# EAGLE design Adafruit Perma Proto Pi - Quarter Size (EAGLE 6.4)
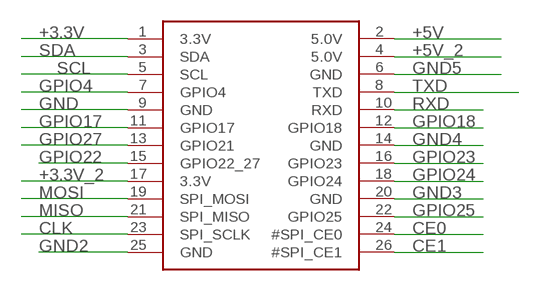
[diagram p0: schematic, sheet 1]

## Parts
JP1  RASBERRYPI_IDC  [RASBERRYPI_IDC]

## Nets
+3.3V: JP1.1(3.3V)
+3.3V_2: JP1.17(3.3V)
+5V: JP1.2(5.0V)
+5V_2: JP1.4(5.0V)
CE0: JP1.24(#SPI_CE0)
CE1: JP1.26(#SPI_CE1)
CLK: JP1.23(SPI_SCLK)
GND: JP1.9(GND)
GND2: JP1.25(GND)
GND3: JP1.20(GND)
GND4: JP1.14(GND)
GND5: JP1.6(GND)
GPIO4: JP1.7(GPIO4)
GPIO17: JP1.11(GPIO17)
GPIO18: JP1.12(GPIO18)
GPIO22: JP1.15(GPIO22_27)
GPIO23: JP1.16(GPIO23)
GPIO24: JP1.18(GPIO24)
GPIO25: JP1.22(GPIO25)
GPIO27: JP1.13(GPIO21)
MISO: JP1.21(SPI_MISO)
MOSI: JP1.19(SPI_MOSI)
RXD: JP1.10(RXD)
SCL: JP1.5(SCL)
SDA: JP1.3(SDA)
TXD: JP1.8(TXD)

## Library data of the parts
JP1 = microbuilder:RASBERRYPI_IDC: Rasberry PI IDC Header

## Board
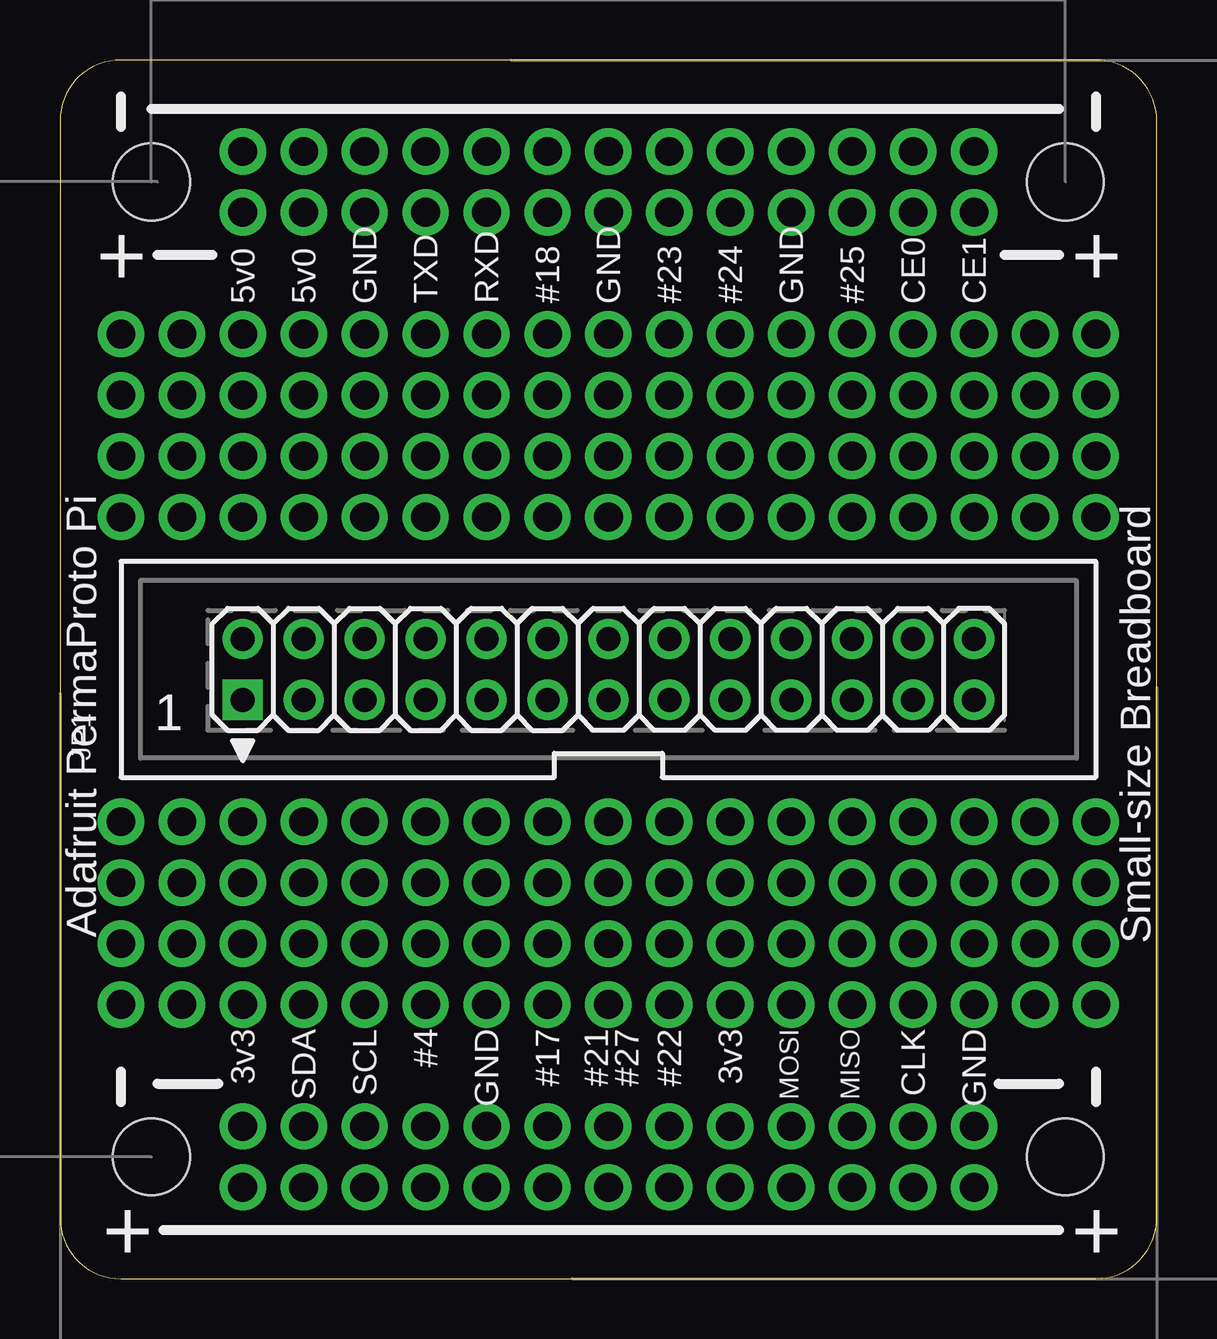
[diagram p1: board, top side]
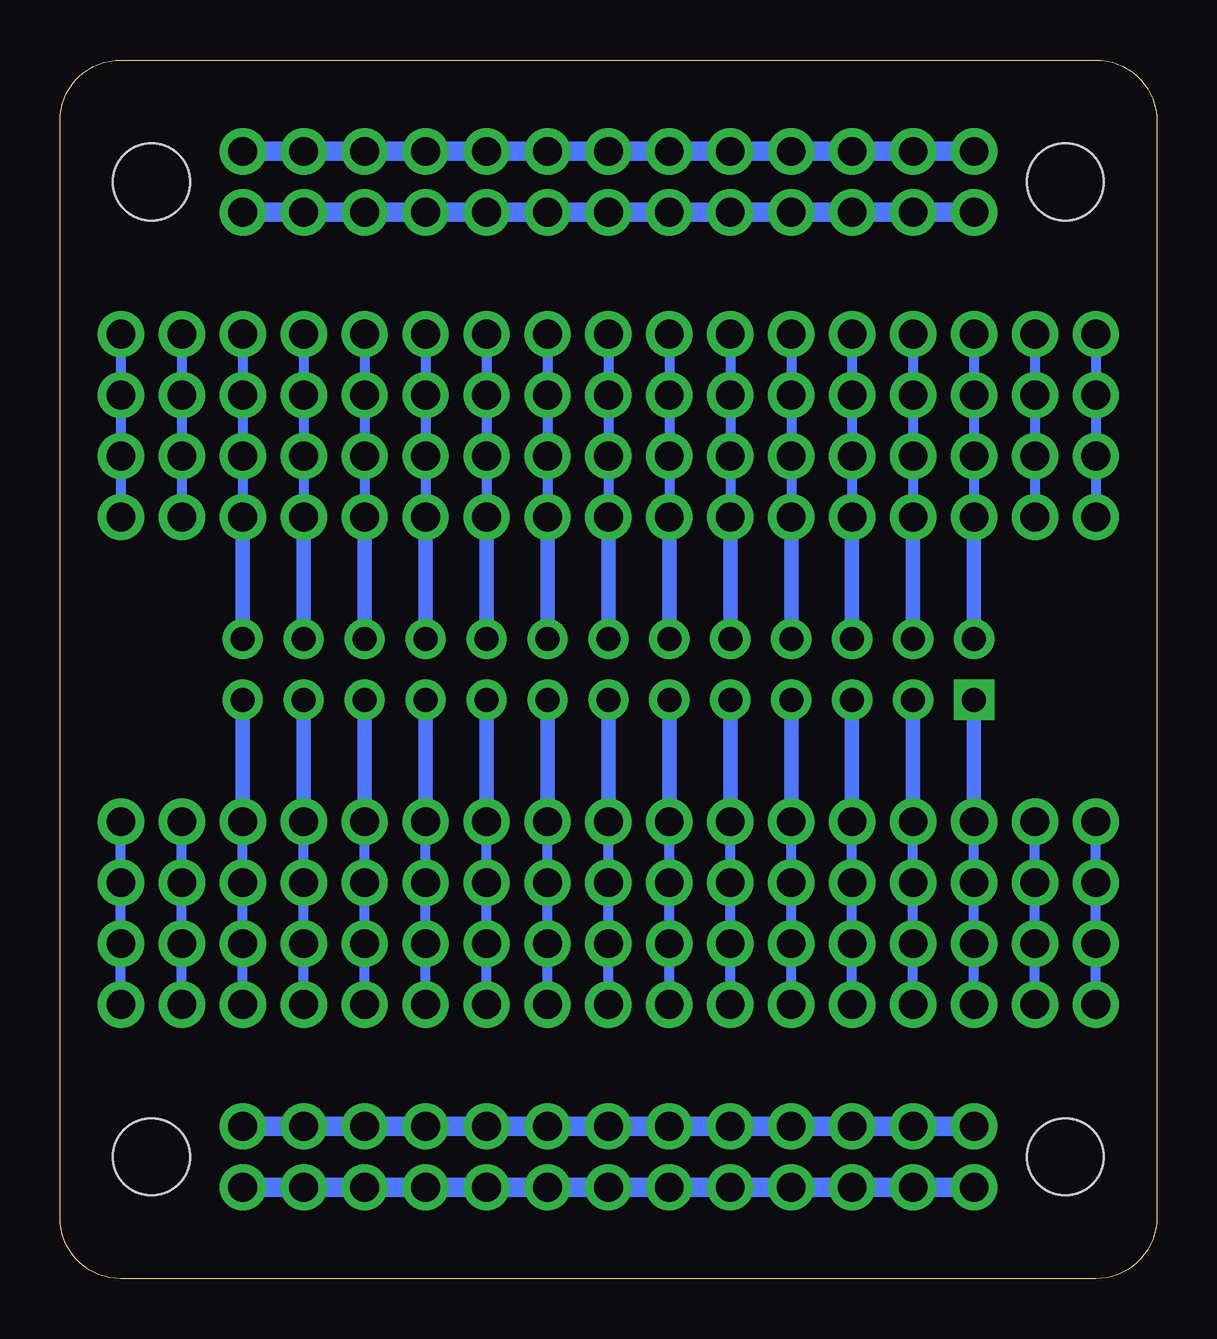
[diagram p2: board, bottom side, seen from below]

Size 45.72 x 50.8 mm. Coordinates in mm from the lower left corner, seen from the top.
Outline: 2.54,50.8 arc90 0,48.26 0,2.54 arc90 2.54,0 43.18,0 arc90 45.72,2.54 45.72,48.26 arc90 43.18,50.8 2.54,50.8
Copper layers (1*16): Top 0.035mm / dielectric 1.5mm / Bottom 0.035mm
Design rules "default": minimum track width 10mil, minimum drill 24mil, track to track 8mil, track to pad 8mil, pad to pad 8mil, via to via 8mil, smd to smd 8mil, copper to edge 40mil, drill to drill 8mil, minimum pad ring 10mil, minimum via ring 8mil, stop-mask expansion 4mil, vias tented up to drill 0mil, thermal gap 10mil
Holes 3.2 mm at 3.81,45.72 3.81,5.08 41.91,45.72 41.91,5.08

### Footprints (pad centres in the part's own frame; a part is rotated, then mirrored left to right if it is on the bottom)
RASBERRYPI_IDC = drill 1 pad 1.676 square: 1 -1.27,15.24 | drill 1 pad 1.676: 2 1.27,15.24; 3 -1.27,12.7; 4 1.27,12.7; 5 -1.27,10.16; 6 1.27,10.16; 7 -1.27,7.62; 8 1.27,7.62; 9 -1.27,5.08; 10 1.27,5.08; 11 -1.27,2.54; 12 1.27,2.54; 13 -1.27,0; 14 1.27,0; 15 -1.27,-2.54; 16 1.27,-2.54; 17 -1.27,-5.08; 18 1.27,-5.08; 19 -1.27,-7.62; 20 1.27,-7.62; 21 -1.27,-10.16; 22 1.27,-10.16; 23 -1.27,-12.7; 24 1.27,-12.7; 25 -1.27,-15.24; 26 1.27,-15.24

### Placement (x,y rotation side)
JP1  22.86,25.4 90 top

### Tracks (layer width: path | path; a pad name or v marks a point on that pad's centre or on a via)
+3.3V  (via drill 1.2 pad 1.93)
  Bottom 0.406: v7.62,19.05 v7.62,16.51 v7.62,13.97 v7.62,11.43
  Bottom 0.61: JP1.1 v7.62,19.05
+3.3V_2  (via drill 1.2 pad 1.93)
  Bottom 0.406: v27.94,19.05 v27.94,16.51 v27.94,13.97 v27.94,11.43
  Bottom 0.61: v27.94,19.05 JP1.17
+5V  (via drill 1.2 pad 1.93)
  Bottom 0.406: v7.62,39.37 v7.62,36.83 v7.62,34.29 v7.62,31.75
  Bottom 0.61: JP1.2 v7.62,31.75
+5V_2  (via drill 1.2 pad 1.93)
  Bottom 0.406: v10.16,39.37 v10.16,36.83 v10.16,34.29 v10.16,31.75
  Bottom 0.61: JP1.4 v10.16,31.75
A1  (via drill 1.2 pad 1.93)
  Bottom 0.406: v2.54,19.05 v2.54,16.51 v2.54,13.97 v2.54,11.43
A2  (via drill 1.2 pad 1.93)
  Bottom 0.406: v2.54,39.37 v2.54,36.83 v2.54,34.29 v2.54,31.75
B1  (via drill 1.2 pad 1.93)
  Bottom 0.406: v5.08,11.43 v5.08,13.97 v5.08,16.51 v5.08,19.05
B2  (via drill 1.2 pad 1.93)
  Bottom 0.406: v5.08,39.37 v5.08,36.83 v5.08,34.29 v5.08,31.75
C1  (via drill 1.2 pad 1.93)
  Bottom 0.406: v40.64,11.43 v40.64,13.97 v40.64,16.51 v40.64,19.05
C2  (via drill 1.2 pad 1.93)
  Bottom 0.406: v40.64,39.37 v40.64,36.83 v40.64,34.29 v40.64,31.75
CE0  (via drill 1.2 pad 1.93)
  Bottom 0.406: v35.56,31.75 v35.56,34.29 v35.56,36.83 v35.56,39.37
  Bottom 0.61: JP1.24 v35.56,31.75
CE1  (via drill 1.2 pad 1.93)
  Bottom 0.406: v38.1,31.75 v38.1,34.29 v38.1,36.83 v38.1,39.37
  Bottom 0.61: v38.1,31.75 JP1.26
CLK  (via drill 1.2 pad 1.93)
  Bottom 0.406: v35.56,11.43 v35.56,13.97 v35.56,16.51 v35.56,19.05
  Bottom 0.61: v35.56,19.05 JP1.23
D1  (via drill 1.2 pad 1.93)
  Bottom 0.406: v43.18,11.43 v43.18,13.97 v43.18,16.51 v43.18,19.05
D2  (via drill 1.2 pad 1.93)
  Bottom 0.406: v43.18,31.75 v43.18,34.29 v43.18,36.83 v43.18,39.37
GND  (via drill 1.2 pad 1.93)
  Bottom 0.406: v17.78,19.05 v17.78,16.51 v17.78,13.97 v17.78,11.43
  Bottom 0.61: JP1.9 v17.78,19.05
GND2  (via drill 1.2 pad 1.93)
  Bottom 0.406: v38.1,19.05 v38.1,16.51 v38.1,13.97 v38.1,11.43
  Bottom 0.61: JP1.25 v38.1,19.05
GND3  (via drill 1.2 pad 1.93)
  Bottom 0.406: v30.48,31.75 v30.48,34.29 v30.48,36.83 v30.48,39.37
  Bottom 0.61: JP1.20 v30.48,31.75
GND4  (via drill 1.2 pad 1.93)
  Bottom 0.406: v22.86,39.37 v22.86,36.83 v22.86,34.29 v22.86,31.75
  Bottom 0.61: JP1.14 v22.86,31.75
GND5  (via drill 1.2 pad 1.93)
  Bottom 0.406: v12.7,31.75 v12.7,34.29 v12.7,36.83 v12.7,39.37
  Bottom 0.61: JP1.6 v12.7,31.75
GNDSTRIP1  (via drill 1.2 pad 1.93)
  Bottom 0.813: v38.1,46.99 v35.56,46.99 v33.02,46.99 v30.48,46.99 v27.94,46.99 v25.4,46.99 v22.86,46.99 v20.32,46.99 v17.78,46.99 v15.24,46.99 v12.7,46.99 v10.16,46.99 v7.62,46.99
GNDSTRIP2  (via drill 1.2 pad 1.93)
  Bottom 0.813: v7.62,6.35 v10.16,6.35 v12.7,6.35 v15.24,6.35 v17.78,6.35 v20.32,6.35 v22.86,6.35 v25.4,6.35 v27.94,6.35 v30.48,6.35 v33.02,6.35 v35.56,6.35 v38.1,6.35
GPIO4  (via drill 1.2 pad 1.93)
  Bottom 0.406: v15.24,11.43 v15.24,13.97 v15.24,16.51 v15.24,19.05
  Bottom 0.61: JP1.7 v15.24,19.05
GPIO17  (via drill 1.2 pad 1.93)
  Bottom 0.406: v20.32,11.43 v20.32,13.97 v20.32,16.51 v20.32,19.05
  Bottom 0.61: JP1.11 v20.32,19.05
GPIO18  (via drill 1.2 pad 1.93)
  Bottom 0.406: v20.32,31.75 v20.32,34.29 v20.32,36.83 v20.32,39.37
  Bottom 0.61: JP1.12 v20.32,31.75
GPIO22  (via drill 1.2 pad 1.93)
  Bottom 0.406: v25.4,11.43 v25.4,13.97 v25.4,16.51 v25.4,19.05
  Bottom 0.61: JP1.15 v25.4,19.05
GPIO23  (via drill 1.2 pad 1.93)
  Bottom 0.406: v25.4,31.75 v25.4,34.29 v25.4,36.83 v25.4,39.37
  Bottom 0.61: JP1.16 v25.4,31.75
GPIO24  (via drill 1.2 pad 1.93)
  Bottom 0.406: v27.94,39.37 v27.94,36.83 v27.94,34.29 v27.94,31.75
  Bottom 0.61: JP1.18 v27.94,31.75
GPIO25  (via drill 1.2 pad 1.93)
  Bottom 0.406: v33.02,39.37 v33.02,36.83 v33.02,34.29 v33.02,31.75
  Bottom 0.61: v33.02,31.75 JP1.22
GPIO27  (via drill 1.2 pad 1.93)
  Bottom 0.406: v22.86,19.05 v22.86,16.51 v22.86,13.97 v22.86,11.43
  Bottom 0.61: JP1.13 v22.86,19.05
MISO  (via drill 1.2 pad 1.93)
  Bottom 0.406: v33.02,19.05 v33.02,16.51 v33.02,13.97 v33.02,11.43
  Bottom 0.61: v33.02,19.05 JP1.21
MOSI  (via drill 1.2 pad 1.93)
  Bottom 0.406: v30.48,19.05 v30.48,16.51 v30.48,13.97 v30.48,11.43
  Bottom 0.61: JP1.19 v30.48,19.05
PWRSTRIP1  (via drill 1.2 pad 1.93)
  Bottom 0.813: v38.1,44.45 v35.56,44.45 v33.02,44.45 v30.48,44.45 v27.94,44.45 v25.4,44.45 v22.86,44.45 v20.32,44.45 v17.78,44.45 v15.24,44.45 v12.7,44.45 v10.16,44.45 v7.62,44.45
PWRSTRIP2  (via drill 1.2 pad 1.93)
  Bottom 0.813: v7.62,3.81 v10.16,3.81 v12.7,3.81 v15.24,3.81 v17.78,3.81 v20.32,3.81 v22.86,3.81 v25.4,3.81 v27.94,3.81 v30.48,3.81 v33.02,3.81 v35.56,3.81 v38.1,3.81
RXD  (via drill 1.2 pad 1.93)
  Bottom 0.406: v17.78,39.37 v17.78,36.83 v17.78,34.29 v17.78,31.75
  Bottom 0.61: JP1.10 v17.78,31.75
SCL  (via drill 1.2 pad 1.93)
  Bottom 0.406: v12.7,19.05 v12.7,16.51 v12.7,13.97 v12.7,11.43
  Bottom 0.61: JP1.5 v12.7,19.05
SDA  (via drill 1.2 pad 1.93)
  Bottom 0.406: v10.16,11.43 v10.16,13.97 v10.16,16.51 v10.16,19.05
  Bottom 0.61: JP1.3 v10.16,19.05
TXD  (via drill 1.2 pad 1.93)
  Bottom 0.406: v15.24,39.37 v15.24,36.83 v15.24,34.29 v15.24,31.75
  Bottom 0.61: JP1.8 v15.24,31.75

### Text on the board
tPlace: 5v0 | 5v0 | GND | TXD | RXD | #18 | GND | #23 | #24 | GND | #25 | CE0 | CE1 | Adafruit PermaProto Pi | Small-size Breadboard | 3v3 | SDA | SCL | #4 | GND | #17 | #21 | #27 | #22 | 3v3 | MOSI | MISO | CLK | GND
tPlaceRed: + | + | + | +